# EAGLE design demo3 (EAGLE 4.60)
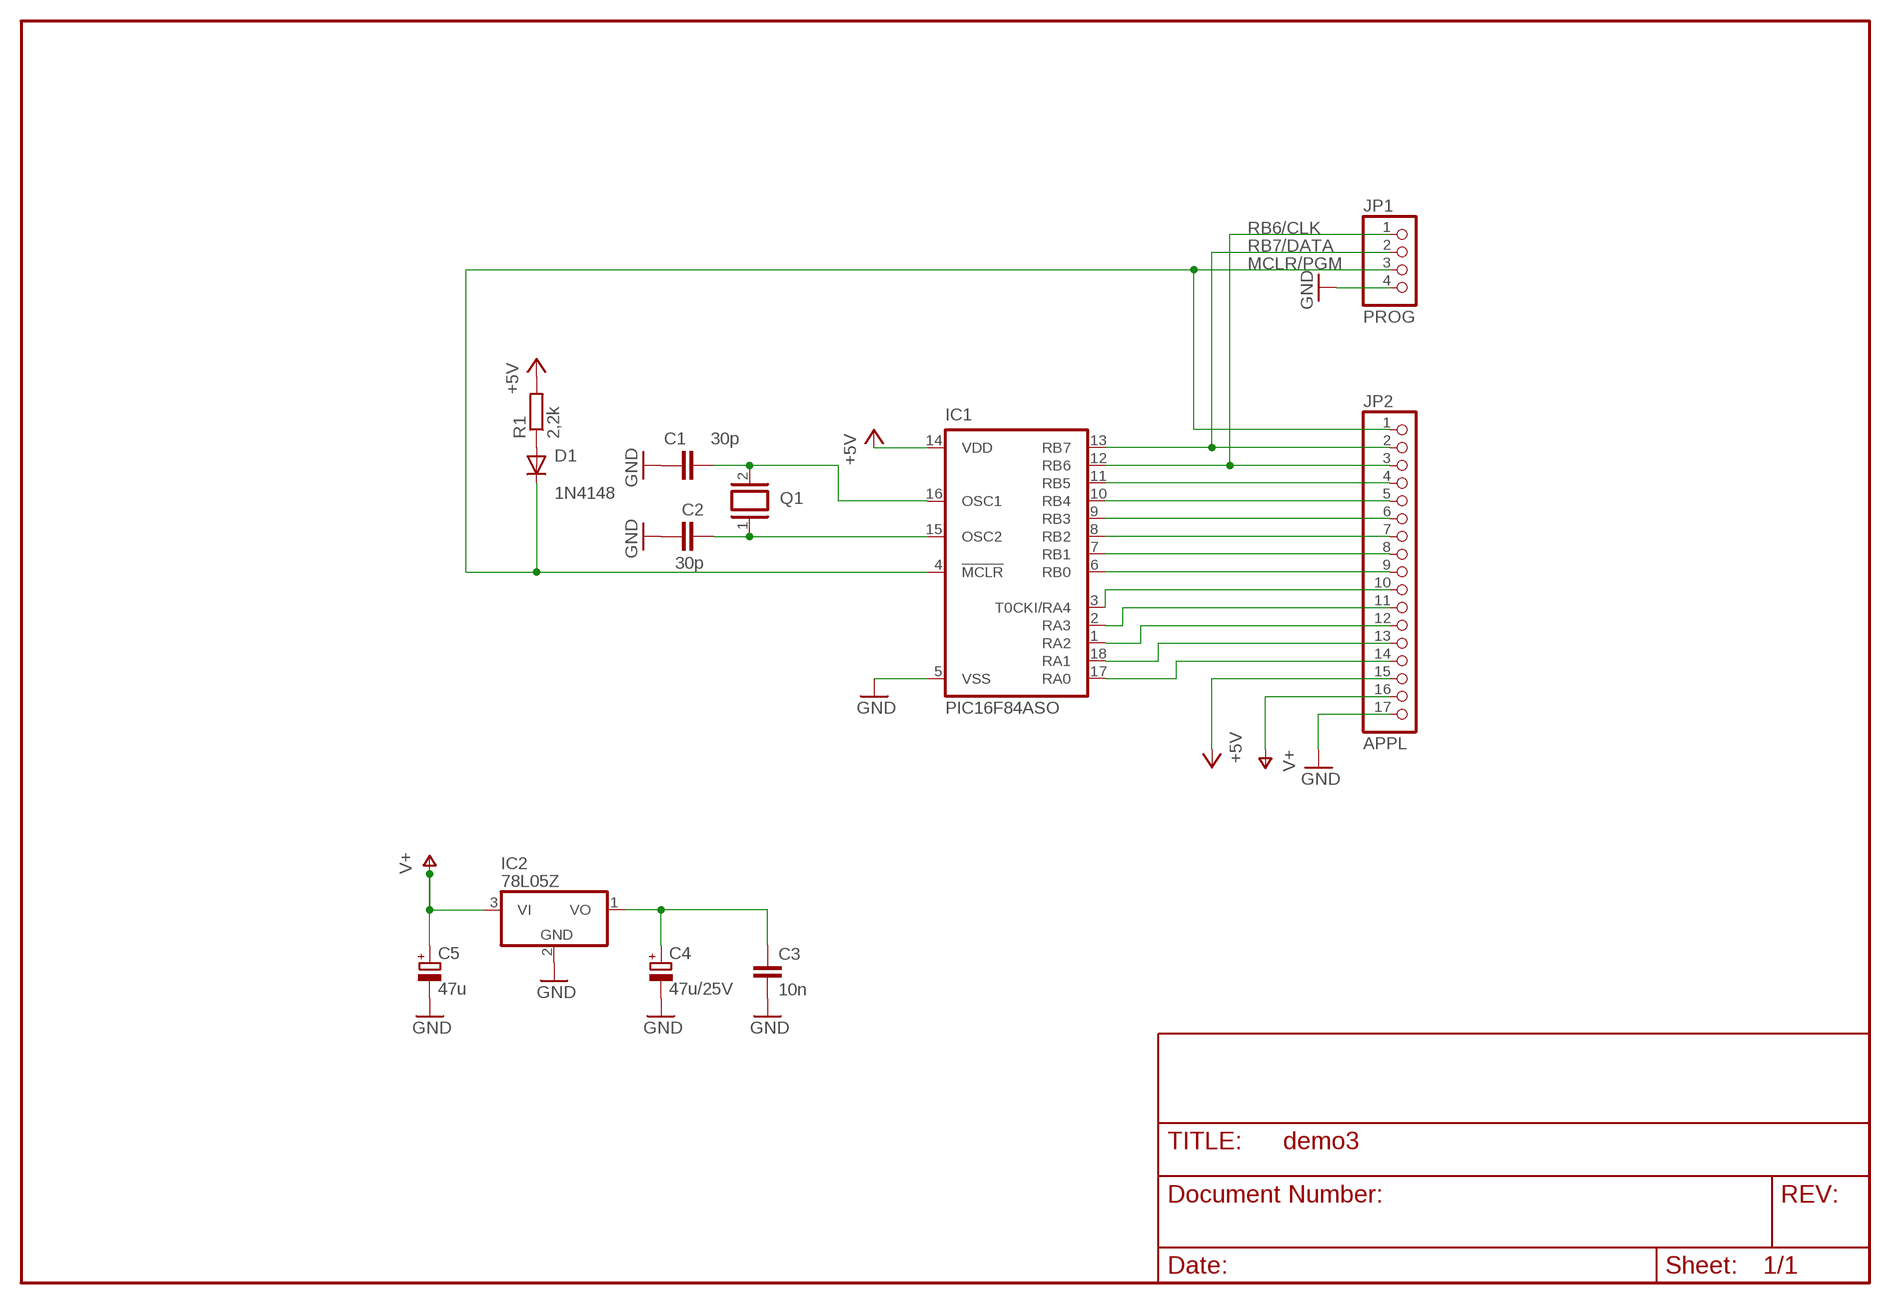
[diagram p0: schematic, sheet 1]

## Parts
C1  30p  C-EUC1206  [C1206]
C2  30p  C-EUC1206  [C1206]
C3  10n  C-EU025-025X050  [C025-025X050]
C4  47u/25V  CPOL-EUTAP5-45  [TAP5-45]
C5  47u  CPOL-EUTAP5-45  [TAP5-45]
D1  1N4148  [DO35-10]
IC1  PIC16F84ASO  [SO-18W]
IC2  78L05Z  [TO92]
JP1  PROG  PINHD-1X4  [1X04]
JP2  APPL  PINHD-1X17  [1X17]
Q1  XTAL/S  [QS]
R1  2,2k  R-EU_R1206  [R1206]

## Nets
+5V [power]: IC1.14(VDD) JP2.15 R1.1
GND [power]: C1.1 C2.1 C3.2 C4.- C5.- IC1.5(VSS) IC2.2(GND) JP1.4 JP2.17
MCLR/PGM: D1.C IC1.4(!MCLR) JP1.3 JP2.1
N$1: C3.1 C4.+ IC2.1(VO)
N$2: C1.2 IC1.16(OSC1) Q1.2
N$3: C2.2 IC1.15(OSC2) Q1.1
N$4: D1.A R1.2
RA0: IC1.17(RA0) JP2.14
RA1: IC1.18(RA1) JP2.13
RA2: IC1.1(RA2) JP2.12
RA3: IC1.2(RA3) JP2.11
RA4: IC1.3(T0CKI/RA4) JP2.10
RB0: IC1.6(RB0) JP2.9
RB1: IC1.7(RB1) JP2.8
RB2: IC1.8(RB2) JP2.7
RB3: IC1.9(RB3) JP2.6
RB4: IC1.10(RB4) JP2.5
RB5: IC1.11(RB5) JP2.4
RB6/CLK: IC1.12(RB6) JP1.1 JP2.3
RB7/DATA: IC1.13(RB7) JP1.2 JP2.2
V+ [power]: C5.+ IC2.3(VI) JP2.16

## Library data of the parts
C1-C3 = rcl:C-EU: CAPACITOR, European symbol
C4 C5 = rcl:CPOL-EU: POLARIZED CAPACITOR, European symbol
D1 = diode:1N4148: DIODE high speed (Philips)
IC1 = microchip:PIC16F8*: MICROCONTROLLER 8-Bit PIC16F8X Family - CMOS Flash/EEPROM Pin Compatible : PIC16F83, PIC16CR83, PIC16F84A, PIC16CR84 see also PIC16C*
IC2 = linear:78*: Positive VOLTAGE REGULATOR
JP1 = pinhead:PINHD-1X4: PIN HEADER
JP2 = pinhead:PINHD-1X17: PIN HEADER
Q1 = special:XTAL/S: CRYSTAL
R1 = rcl:R-EU_: RESISTOR, European symbol

## Net classes
0 default: width 0.3 mm, drill 0.6 mm, clearance 0.2 mm
1 power: width 0.4 mm, drill 0.6 mm, clearance 0.2 mm

## Board
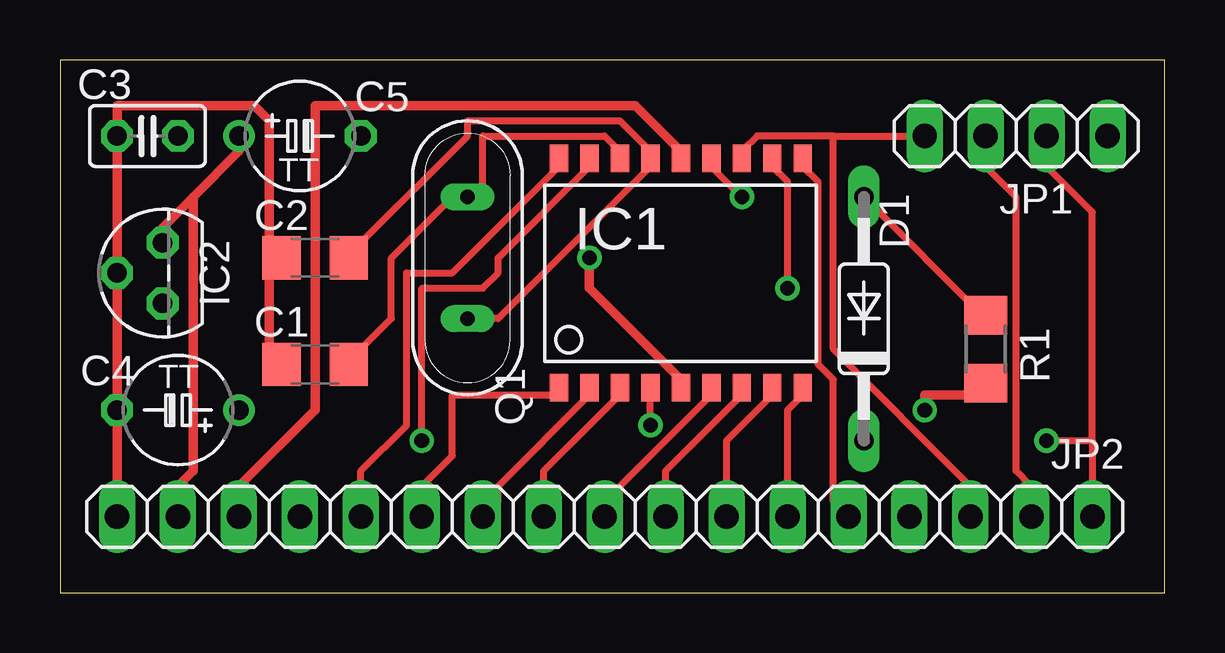
[diagram p1: board, top side]
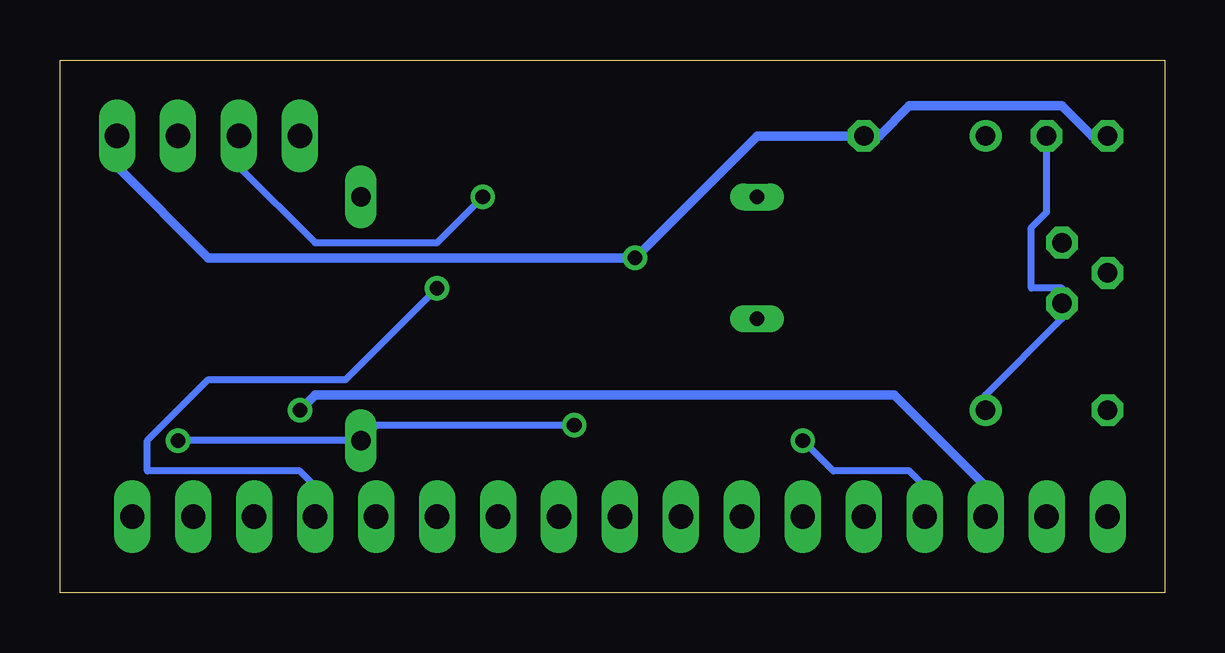
[diagram p2: board, bottom side, seen from below]

Size 46.02 x 22.21 mm. Coordinates in mm from the lower left corner, seen from the top.
Outline: 0,0 46.02,0 46.02,22.21 0,22.21 0,0
Copper layers (1*16): Top 0.035mm / dielectric 1.5mm / Bottom 0.035mm
Design rules "default": minimum track width 10mil, minimum drill 24mil, track to track 8mil, track to pad 8mil, pad to pad 8mil, via to via 8mil, smd to smd 8mil, copper to edge 40mil, drill to drill 8mil, minimum pad ring 10mil, minimum via ring 8mil, stop-mask expansion 4mil, vias tented up to drill 0mil, thermal gap 10mil

### Footprints (pad centres in the part's own frame; a part is rotated, then mirrored left to right if it is on the bottom)
C1206 = smd 1.6 x 1.8: 1 -1.4,0; 2 1.4,0
C025-025X050 = drill 0.813 octagon: 1 -1.27,0; 2 1.27,0
TAP5-45 = drill 0.813 round: + -2.54,0 | drill 0.813 octagon: - 2.54,0
DO35-10 = drill 0.813 long: A 5.08,0; C -5.08,0
SO-18W = smd 0.762 x 1.143: 1 -5.08,-4.788; 2 -3.81,-4.788; 3 -2.54,-4.788; 4 -1.27,-4.788; 5 0,-4.788; 6 1.27,-4.788; 7 2.54,-4.788; 8 3.81,-4.788; 9 5.08,-4.788; 10 5.08,4.788; 11 3.81,4.788; 12 2.54,4.788; 13 1.27,4.788; 14 0,4.788; 15 -1.27,4.788; 16 -2.54,4.788; 17 -3.81,4.788; 18 -5.08,4.788
TO92 = drill 0.813 octagon: 1 -1.27,0; 2 0,1.905; 3 1.27,0
1X04 = drill 1.016 long: 1 -3.81,0; 2 -1.27,0; 3 1.27,0; 4 3.81,0
1X17 = drill 1.016 long: 1 -20.32,0; 2 -17.78,0; 3 -15.24,0; 4 -12.7,0; 5 -10.16,0; 6 -7.62,0; 7 -5.08,0; 8 -2.54,0; 9 0,0; 10 2.54,0; 11 5.08,0; 12 7.62,0; 13 10.16,0; 14 12.7,0; 15 15.24,0; 16 17.78,0; 17 20.32,0
QS = drill 0.61 long: 1 -2.54,0; 2 2.54,0
R1206 = smd 1.6 x 1.803: 1 -1.422,0; 2 1.422,0

### Placement (x,y rotation side)
C1  10.63,9.52 0 top
C2  10.63,13.97 0 top
C3  3.64,19.04 180 top
C4  4.92,7.62 180 top
C5  10,19.04 0 top
D1  33.49,11.43 90 top
IC1  25.87,13.33 0 top
IC2  4.28,13.33 90 top
JP1  39.84,19.04 0 top
JP2  22.7,3.17 180 top
Q1  16.98,13.97 90 top
R1  38.57,10.16 90 top

### Tracks (layer width: path | path; a pad name or v marks a point on that pad's centre or on a via)
+5V  (via drill 0.61)
  Top 0.4: IC1.14 25.87,18.41 23.96,20.31 10.63,20.31 10.63,7.62 7.46,4.44 JP2.15 | v36.03,7.62 36.03,8.25 37.94,8.25 R1.1
  Bottom 0.4: v36.03,7.62 35.39,8.25 11.27,8.25 7.46,4.44 JP2.15
GND  (via drill 0.61)
  Top 0.4: C1.1 8.73,10.16 8.73,13.33 C2.1 8.73,14.6 8.73,19.68 8.09,20.31 2.38,20.31 2.38,19.68 C3.2 2.38,18.41 2.38,13.97 IC2.2 2.38,12.7 2.38,8.25 C4.- 2.38,6.98 2.38,4.44 JP2.17 | v22.06,13.97 22.06,12.7 25.87,8.89 IC1.5
  Bottom 0.4: JP1.4 43.65,17.77 39.84,13.97 v22.06,13.97 16.98,19.04 13.17,19.04 C5.- 11.9,19.04 10.63,20.31 4.28,20.31 3.01,19.04 C3.2
MCLR/PGM  (via drill 0.61)
  Top 0.3: v24.6,6.98 24.6,8.25 IC1.4 | 43.02,6.34 43.02,4.44 JP2.1 | 43.02,6.34 43.02,15.87 41.11,17.77 JP1.3 | v41.11,6.34 43.02,6.34
  Bottom 0.3: v24.6,6.98 32.85,6.98 D1.C 34.12,6.34 v41.11,6.34
N$1
  Bottom 0.3: C4.+ 7.46,8.25 4.28,11.43 IC2.1 4.28,12.7 5.55,12.7 5.55,15.24 4.92,15.87 4.92,18.41 C3.1
N$2
  Top 0.3: IC1.16 23.33,18.41 22.7,19.04 17.61,19.04 17.61,16.5 Q1.2 16.34,16.5 13.81,13.97 13.81,11.43 12.54,10.16 C1.2
N$3
  Top 0.3: Q1.1 17.61,11.43 18.25,11.43 24.6,17.77 IC1.15 24.6,18.41 23.33,19.68 16.98,19.68 16.98,19.04 12.54,14.6 C2.2
N$4
  Top 0.3: D1.A 34.12,15.87 37.94,12.06 R1.2
RA0  (via drill 0.61)
  Top 0.3: v15.08,6.34 15.08,12.7 17.61,12.7 18.25,13.33 18.25,13.97 22.06,17.77 IC1.17
  Bottom 0.3: v15.08,6.34 13.81,5.08 10.63,5.08 10,4.44 JP2.14
RA1
  Top 0.3: IC1.18 20.79,17.77 16.34,13.33 14.44,13.33 14.44,6.98 12.54,5.08 12.54,4.44 JP2.13
RA2
  Top 0.3: IC1.1 20.79,8.25 16.34,8.25 16.34,5.71 15.08,4.44 JP2.12
RA3
  Top 0.3: IC1.2 22.06,8.25 18.25,4.44 18.25,3.8 JP2.11
RA4
  Top 0.3: IC1.3 23.33,8.25 20.15,5.08 20.15,4.44 JP2.10
RB0
  Top 0.3: IC1.6 27.14,8.25 23.33,4.44 23.33,3.8 JP2.9
RB1
  Top 0.3: IC1.7 28.41,8.25 25.23,5.08 25.23,4.44 JP2.8
RB2
  Top 0.3: IC1.8 29.68,8.25 27.77,6.34 27.77,4.44 JP2.7
RB3
  Top 0.3: IC1.9 30.95,8.25 30.31,7.62 30.31,4.44 JP2.6
RB4
  Top 0.3: IC1.10 30.95,17.77 31.58,17.14 31.58,9.52 32.22,8.89 32.22,3.8 JP2.5
RB5  (via drill 0.61)
  Top 0.3: v30.31,12.7 30.31,17.14 29.68,17.77 IC1.11
  Bottom 0.3: v30.31,12.7 34.12,8.89 39.84,8.89 42.38,6.34 42.38,5.08 36.03,5.08 35.39,4.44 JP2.4
RB6/CLK
  Top 0.3: 32.22,19.04 35.39,19.04 JP1.1 | 32.22,19.04 29.04,19.04 28.41,18.41 IC1.12 | 32.22,19.04 32.22,10.16 37.94,4.44 JP2.3
RB7/DATA  (via drill 0.61)
  Top 0.3: v28.41,16.5 27.14,17.77 IC1.13 | JP2.2 40.48,4.44 39.84,5.08 39.84,16.5 38.57,17.77 JP1.2
  Bottom 0.3: v28.41,16.5 30.31,14.6 35.39,14.6 38.57,17.77 JP1.2
V+
  Top 0.4: 5.55,16.5 7.46,18.41 C5.+ | 5.55,16.5 4.28,15.24 IC2.3 | 5.55,16.5 5.55,5.08 4.92,4.44 JP2.16